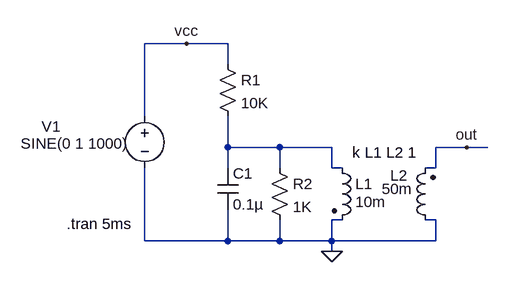
[diagram p0: schematic Draft1.asc]
Draft1.asc, the LTspice schematic file:
Version 4
SHEET 1 880 680
WIRE 144 0 80 0
WIRE 208 0 144 0
WIRE 208 32 208 0
WIRE 80 112 80 0
WIRE 208 160 208 112
WIRE 288 160 208 160
WIRE 368 160 288 160
WIRE 576 160 528 160
WIRE 608 160 576 160
WIRE 208 192 208 160
WIRE 288 192 288 160
WIRE 368 192 368 160
WIRE 384 192 368 192
WIRE 528 192 528 160
WIRE 528 192 512 192
WIRE 384 272 368 272
WIRE 528 272 512 272
WIRE 80 304 80 192
WIRE 208 304 208 256
WIRE 208 304 80 304
WIRE 288 304 288 272
WIRE 288 304 208 304
WIRE 368 304 368 272
WIRE 368 304 288 304
WIRE 528 304 528 272
WIRE 528 304 368 304
WIRE 368 320 368 304
FLAG 368 320 0
FLAG 144 0 vcc
FLAG 576 160 out
SYMBOL res 192 16 R0
SYMATTR InstName R1
SYMATTR Value 10K
SYMBOL res 272 176 R0
SYMATTR InstName R2
SYMATTR Value 1K
SYMBOL voltage 80 96 R0
WINDOW 0 -159 32 Left 2
WINDOW 3 -191 58 Left 2
WINDOW 123 0 0 Left 2
WINDOW 39 0 0 Left 2
SYMATTR InstName V1
SYMATTR Value SINE(0 1 1000)
SYMBOL cap 192 192 R0
SYMATTR InstName C1
SYMATTR Value 0.1µ
SYMATTR SpiceLine V=16 Irms=728m Rser=0.14361 Lser=0 mfg="KEMET" pn="C0603C104K4RAC" type="X7R"
SYMBOL ind2 368 176 R0
WINDOW 3 36 68 Left 2
SYMATTR InstName L1
SYMATTR Value 10m
SYMATTR Type ind
SYMBOL ind2 528 288 R180
WINDOW 0 43 85 Left 2
WINDOW 3 36 64 Left 2
SYMATTR InstName L2
SYMATTR Value 50m
SYMATTR Type ind
TEXT -40 278 Left 2 !.tran 5ms
TEXT 400 168 Left 2 !k L1 L2 1

The netlist it stands for:
* Draft1.asc
R1 vcc N001 10K
R2 N001 0 1K
V1 vcc 0 SINE(0 1 1000)
C1 N001 0 0.1µ V=16 Irms=728m Rser=0.14361 Lser=0 mfg="KEMET" pn="C0603C104K4RAC" type="X7R"
L1 N001 0 10m
L2 0 out 50m
.tran 5ms
k L1 L2 1
.backanno
.end